# Altium project BOARD_CONN_805_24PIN.PrjPcb
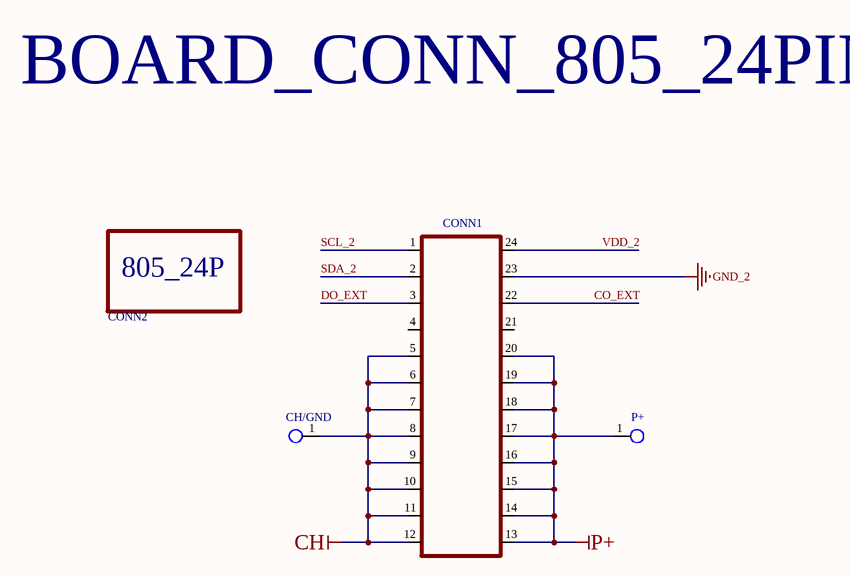
[diagram p0: BOARD_CONN_805_24PIN.SchDoc]
1 sheet, 4 parts. Net scope: global (net labels, ports and power ports of the same name join across sheets).
Board file: BOARD_CONN_805_24PIN.PcbDoc

## Sheet BOARD_CONN_805_24PIN.SchDoc
size A4; SheetNumber: 1; SheetTotal: 1

### Parts
CH/GND  Test_Point_PCB  [Test_Point]  (value not drawn)
CONN1  CONN_805_24P  [CONN_805_24P]  (value not drawn)
CONN2  805_24P  [805_24P]  (value not drawn)
P+  Test_Point_PCB  [Test_Point]  (value not drawn)

### Nets
CH: CH/GND.1(G9) CONN1.5 CONN1.6 CONN1.7 CONN1.8 CONN1.9 CONN1.10 CONN1.11 CONN1.12
GND_2: CONN1.23
P+: CONN1.13 CONN1.14 CONN1.15 CONN1.16 CONN1.17 CONN1.18 CONN1.19 CONN1.20 P+.1(G9)
CO_EXT: CONN1.22
DO_EXT: CONN1.3
SCL_2: CONN1.1
SDA_2: CONN1.2
VDD_2: CONN1.24

Not connected (* = marked no-connect by the designer): CONN1 4 21

### Notes on the sheet
- BOARD_CONN_805_24PIN

### Library data of the parts
CH/GND P+ = TP_PCB?: Test_Point